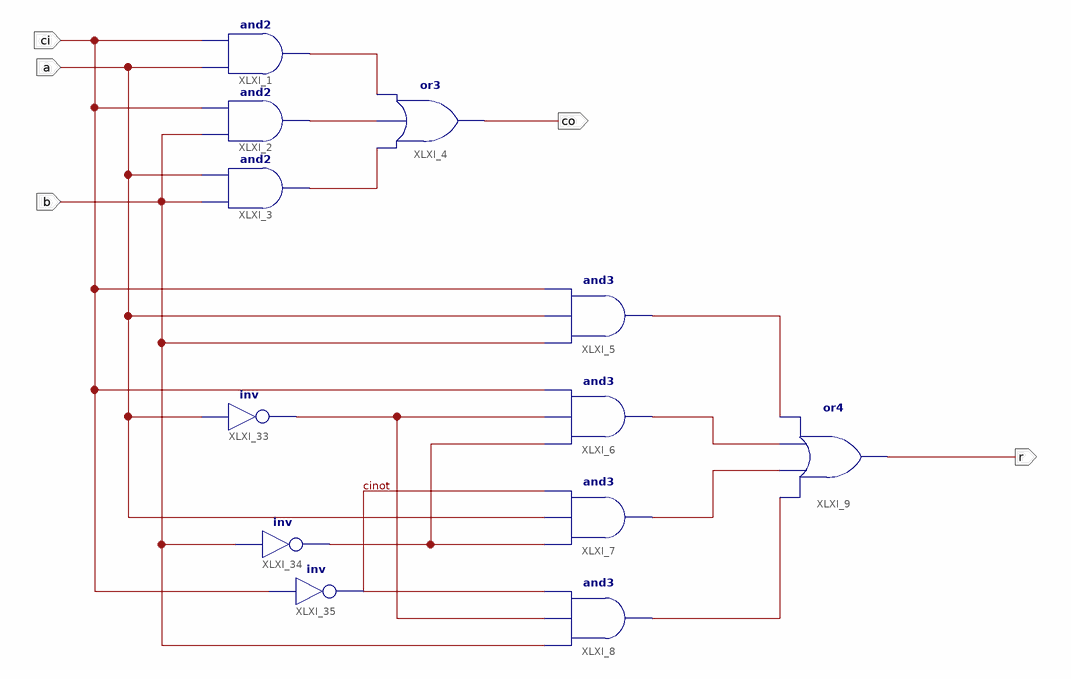
[diagram p0: schematic sheet 1]
// Xilinx ISE schematic add1b.sch (virtex) as structural Verilog: 12 symbols, 5 ports
module add1b (
  input  ci,
  input  b,
  input  a,
  output co,
  output r
);

  wire anot, bnot, cinot, XLXN_1, XLXN_2, XLXN_3, XLXN_11, XLXN_12, XLXN_13, XLXN_14;

  and XLXI_1 (XLXN_1, a, ci);
  and XLXI_2 (XLXN_2, b, ci);
  and XLXI_3 (XLXN_3, b, a);
  or XLXI_4 (co, XLXN_3, XLXN_2, XLXN_1);
  and XLXI_5 (XLXN_11, b, a, ci);
  and XLXI_6 (XLXN_12, bnot, anot, ci);
  and XLXI_7 (XLXN_13, bnot, a, cinot);
  and XLXI_8 (XLXN_14, b, anot, cinot);
  or XLXI_9 (r, XLXN_14, XLXN_13, XLXN_12, XLXN_11);
  not XLXI_33 (anot, a);
  not XLXI_35 (cinot, ci);
  not XLXI_34 (bnot, b);
endmodule
